# Altium schematic sheet power_conversion.SchDoc: Power conversion
size A4; SheetNumber: 5; SheetTotal: 11
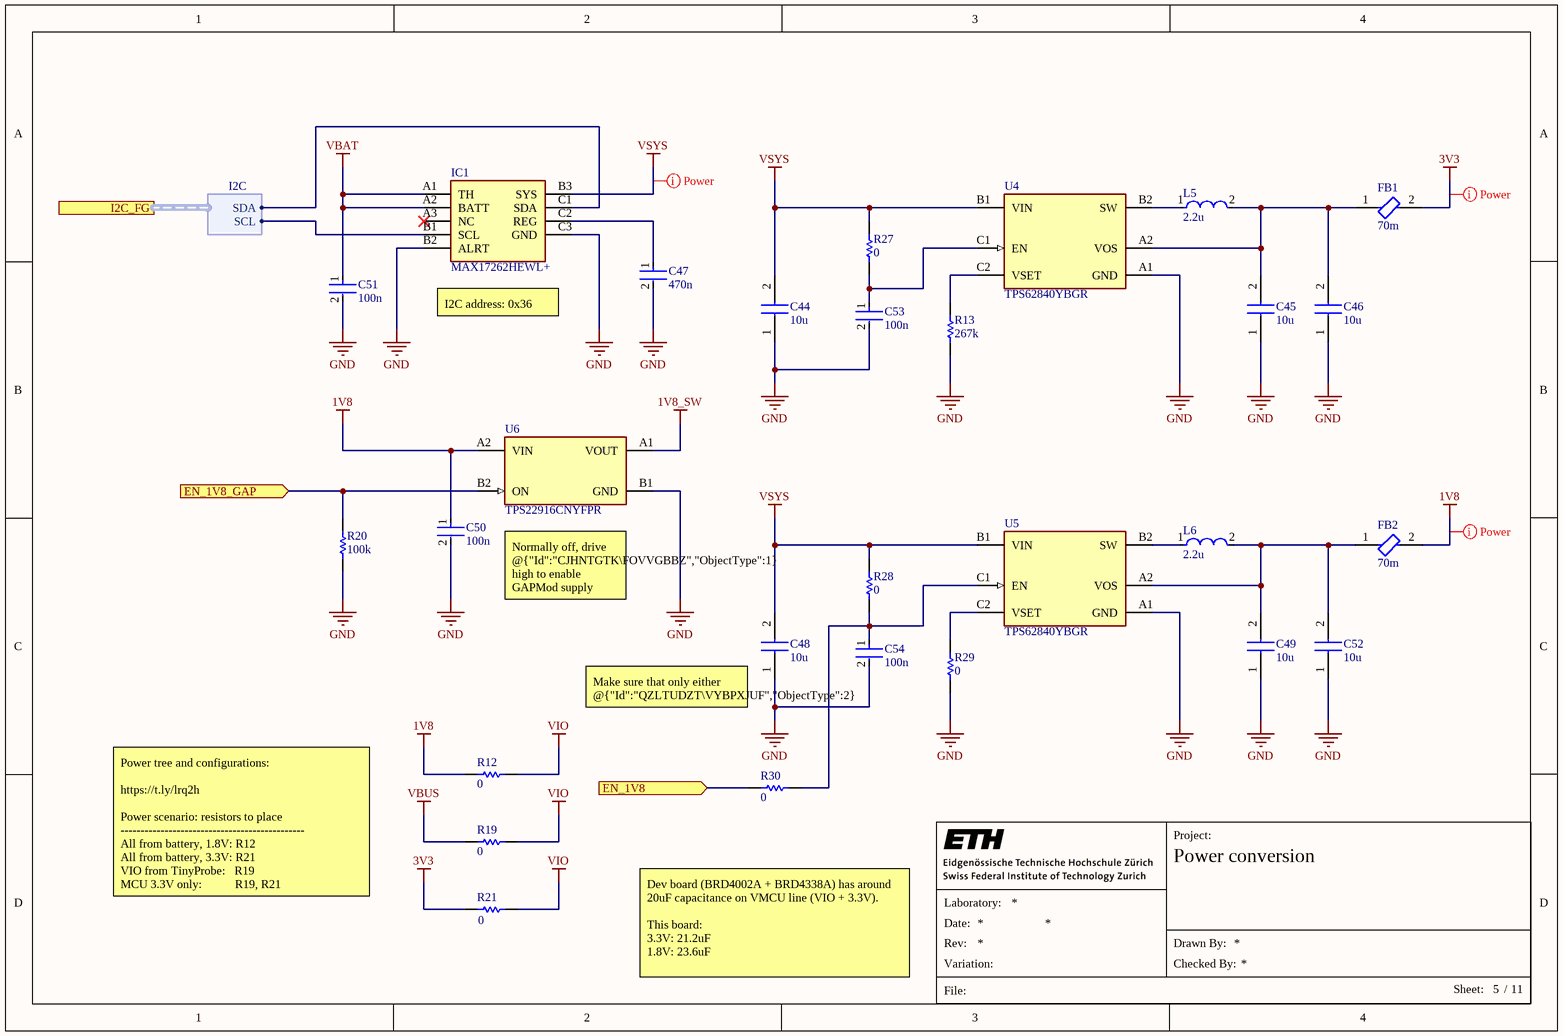
[diagram p0: power_conversion.SchDoc]

## Parts
C44  10u  [CAPC1608X100N]
C45  10u  [CAPC1608X100N]
C46  10u  [CAPC1608X100N]
C47  470n  [FP-GRM15-0_1-MFG]
C48  10u  [CAPC1608X100N]
C49  10u  [CAPC1608X100N]
C50  100n  [FP-GRT155-0_05-MFG]
C51  100n  [FP-GRT155-0_05-MFG]
C52  10u  [CAPC1608X100N]
C53  100n  [FP-GRT155-0_05-MFG]
C54  100n  [FP-GRT155-0_05-MFG]
FB1  70m  [FP-BLM15-0_05-MFG]
FB2  70m  [FP-BLM15-0_05-MFG]
IC1  MAX17262HEWL+  [BGA9C40P3X3_153X153X69]
L5  2.2u  [FP-DFE201612C-MFG]
L6  2.2u  [FP-DFE201612C-MFG]
R12  value 0  [RESC1005X40X25ML05T10]  (hidden comment: Resistor 0R 0402 63 mW)
R13  267k  [RESC1005X40X25LL05T10]
R19  value 0  [RESC1005X40X25ML05T10]  (hidden comment: Resistor 0R 0402 63 mW)
R20  100k  [RESC1005X40X25NL05T10]
R21  value 0  [RESC1005X40X25ML05T10]  (hidden comment: Resistor 0R 0402 63 mW)
R27  value 0  [RESC1005X40X25ML05T10]  (hidden comment: Resistor 0R 0402 63 mW)
R28  value 0  [RESC1005X40X25ML05T10]  (hidden comment: Resistor 0R 0402 63 mW)
R29  value 0  [RESC1005X40X25ML05T10]  (hidden comment: Resistor 0R 0402 63 mW)
R30  value 0  [RESC1005X40X25ML05T10]  (hidden comment: Resistor 0R 0402 63 mW)
U4  TPS62840YBGR  [FP-YBG0006-MFG]
U5  TPS62840YBGR  [FP-YBG0006-MFG]
U6  TPS22916CNYFPR  [FP-YFP0004-IPC_C]

## Ports
EN_1V8 (in, see main[4C], io_a[3B], power_io[6B]), EN_1V8_GAP (in, see main[4C], io_a[3B], power_io[6B]), I2C_FG (harness I2C, see main[4C], connectors[2B], io_b[4B], power_io[6C])

## Harnesses
I2C: SDA, SCL

## Nets
1V8: C50.1 FB2.2 R12.2 U6.A2(VIN)
1V8_SW: U6.A1(VOUT)
3V3: FB1.2 R21.1
GND: C44.1 C45.1 C46.1 C47.2 C48.1 C49.1 C50.2 C51.2 C52.1 C53.2 C54.2 IC1.B2(ALRT) IC1.C3(GND) R13.1 R20.1 R29.2 U4.A1(GND) U5.A1(GND) U6.B1(GND)
VBAT: C51.1 IC1.A1(TH) IC1.A2(BATT)
VBUS: R19.2
VIO: R12.1 R19.1 R21.2
VSYS: C44.2 C48.2 IC1.B3(SYS) R27.1 R28.1 U4.B1(VIN) U5.B1(VIN)
EN_1V8: R30.1 ; port EN_1V8
EN_1V8_GAP: R20.2 U6.B2(ON) ; port EN_1V8_GAP
NetC45_2: C45.2 C46.2 FB1.1 L5.2 U4.A2(VOS)
NetC47_1: C47.1 IC1.C2(REG)
NetC49_2: C49.2 C52.2 FB2.1 L6.2 U5.A2(VOS)
NetC53_1: C53.1 R27.2 U4.C1(EN)
NetC54_1: C54.1 R28.2 R30.2 U5.C1(EN)
NetIC1_B1: IC1.B1(SCL) ; port I2C_FG.SCL
NetIC1_C1: IC1.C1(SDA) ; port I2C_FG.SDA
NetL5_1: L5.1 U4.B2(SW)
NetL6_1: L6.1 U5.B2(SW)
NetR13_2: R13.2 U4.C2(VSET)
NetR29_1: R29.1 U5.C2(VSET)

Not connected (* = marked no-connect by the designer): IC1 A3(NC)*

## Layout directives
net class Power: 1V8, 3V3, VSYS

## Notes on the sheet
- (near IC1) I2C address: 0x36
- Normally off, drive @{"Id":"CJHNTGTK\FOVVGBBZ","ObjectType":1} high to enable GAPMod supply
- (near C48) Make sure that only either @{"Id":"QZLTUDZT\VYBPXJUF","ObjectType":2} or @{"Id":"QZLTUDZT\XKOCDFZE","ObjectType":2} is mounted
- Power tree and configurations:
  https://t.ly/lrq2h
  Power scenario: resistors to place
  ----------------------------------------------
  All from battery, 1.8V: R12
  All from battery, 3.3V: R21
  VIO from TinyProbe:   R19
  MCU 3.3V only:           R19, R21
- Dev board (BRD4002A + BRD4338A) has around 20uF capacitance on VMCU line (VIO + 3.3V).
  This board:
  3.3V: 21.2uF
  1.8V: 23.6uF
- Project:
- Laboratory:
- Date:
- File:
- Rev:
- Variation:
- Drawn By:
- Checked By:
- Sheet:
- /

## Library data of the parts
C44-C46 C48 C49 C52 = GMC10X7R106K10NT: Cap Cer 10UF 10V X7R 0603; Manufacturer_Name: Cal-Chip; Datasheet Link: https://88ce57.p3cdn1.secureserver.net/wp-content/uploads/2023/01/gmc_series-2.pdf; Height: 1mm; Manufacturer_Part_Number: GMC10X7R106K10NT; Supplier 1: Digikey; Supplier Part Number 1: 4713-GMC10X7R106K10NTCT-ND
C47 = CMP-2000-05009-2: CAP CER 0.47UF 10V X5R 0402; Manufacturer: Murata Electronics North America; Manufacturer Part Number: GRM155R61A474KE15D; Temperature Coefficient: 15%; Material: Ceramic; Tolerance: 10%; Device Class L3: Ceramic Capacitors; ComponentLink2Description: Datasheet; ComponentLink2URL: https://search.murata.co.jp/Ceramy/image/img/A01X/G101/ENG/GRM155R61A474KE15-01A.pdf; Package: GRM15-0.1; Voltage Rating: 10V; Capacitance: 0.47uF; Category: Cap; Temperature Range High: +85°C; Temperature Range Low: -55°C; Height: 0.55mm; Device Class L2: Capacitors; Lead Free: Yes; Mouser Description: Multilayer Ceramic Capacitors MLCC - SMD/SMT 0402 0.47uF 10volts X5R 10%; Ipc Land Pattern Name: CAPC10050X50; Temperature Characteristic: X5R; Digikey Description: CAP CER 0.47UF 10V X5R 0402; Value: 0.47uF; Octopart: https://octopart.com/grm155r61a474ke15d-murata-196883; Automotive: No; Device Class L1: Passive Components; Temperature: -55°C to +85°C; RoHS: TRUE
C50 C51 C53 C54 = CMP-06035-014200-1: Multi-Layer Ceramic Capacitor 100nF 50V X7R ±10% 0402 Paper T/R
FB1 FB2 = CMP-0686-00284-4: Chip Ferrite Bead, 0402, 80Ω @ 100MHz, 0.07Ω, 25%, 1.5A; Number of Lines: 1; DC Resistance-Max: 70mR; Impedance: 80R; Height: 0.5mm; Package Quantity: 1; RoHS Compliant: Yes; Max Operating Temperature: 125°C; Depth: 0.5mm; Max Current Rating: 1.5A; Max DC Current: 1.5A; Current Rating: 1.5A; Number of Pins: 2; Case Code (Imperial): 0402; Case/Package: 0402; Case Code (Metric): 1005; Material: Ferrite; Packaging: Tape and Reel; REACH SVHC: No SVHC; Length: 1mm; Tolerance: 25%; Termination: SMD/SMT; Series: BLM15PD; Number of Circuits: 1; Test Frequency: 100MHz; DC Resistance (DCR): 70mR; Min Operating Temperature: -55°C; Lead Free: Lead Free; Width: 0.5mm
IC1 = MAX17262HEWL+: Integrated Circuit; Manufacturer_Name: Analog Devices; Datasheet Link: https://www.analog.com/MAX17262/datasheet; Height: 0.69mm; Manufacturer_Part_Number: MAX17262HEWL+
L5 L6 = CMP-06042-009962-1: Shielded Wirewound Inductor 2.2uH 20% 1800mA 0.116Ω 0806 (2016)
R12 R19 R21 R27-R30 = CMP-009-00004-5: Chip Resistor, 0 Ohm, 0.063 W, -55 to 155 degC, 0402 (1005 Metric); Power: 63mW; Voltage Rating: 50V; Max Operating Temperature: 155°C; Pins: 2; RoHS Compliant: True; Min Operating Temperature: -55°C; Mounting Technology: SM; Case/Package: 0402
R13 = CMP-2002-07544-1: Manufacturer: Yageo; Part Number: RC0402FR-07267KL
R20 = CMP-2002-07343-1: Part Number: RC0402FR-07100KL; Manufacturer: Yageo / Phycomp
U4 U5 = CMP-04918-000401-1: ULTRA LOW IQ BUCK CONVERTER
U6 = CMP-04910-000105-1: IC PWR SWITCH P-CHAN 1:1 4DSBGA; Max Output Current: 2A; Number of Outputs: 1; Fault Protection: Reverse Current; Output Configuration: High Side; RoHS Compliant: Yes; Min Operating Temperature: -40°C; Packaging: Cut Tape; Number of Channels: 1; Max Operating Temperature: 85°C